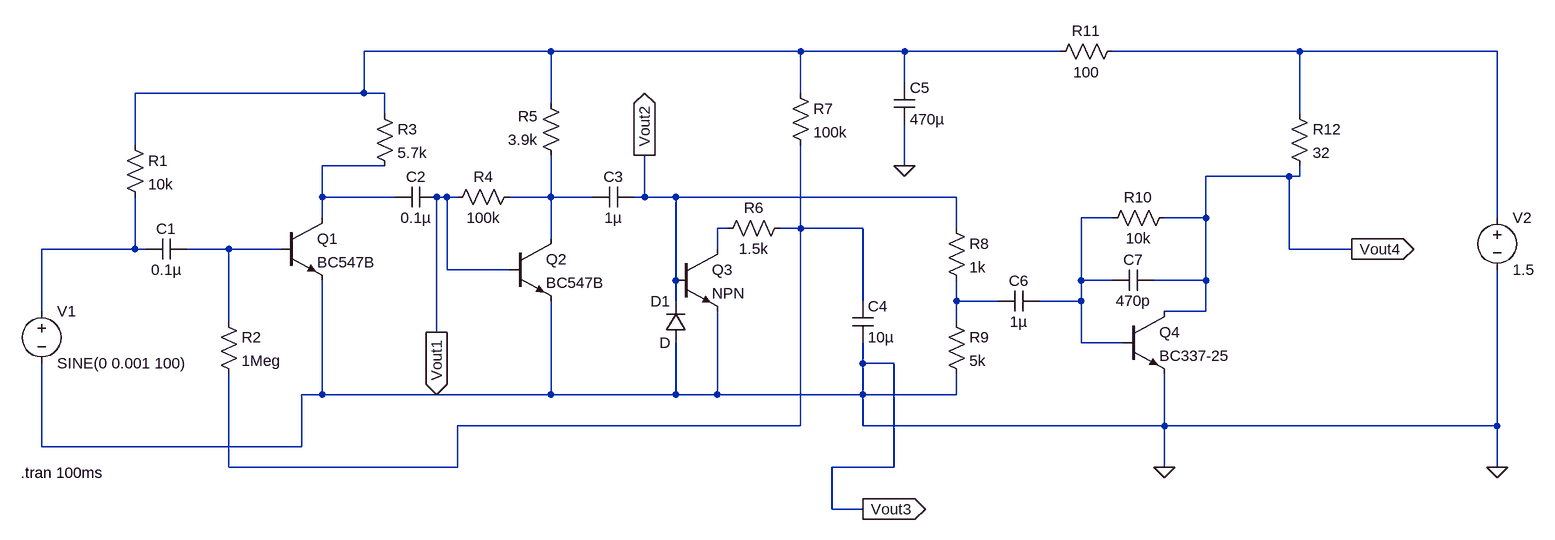
[diagram p0: schematic HearingAid.asc]
HearingAid.asc, the LTspice schematic file:
Version 4
SHEET 1 2432 688
WIRE 496 -128 208 -128
WIRE 880 -128 496 -128
WIRE 1040 -128 880 -128
WIRE 1280 -128 1040 -128
WIRE 1648 -128 1360 -128
WIRE 1952 -128 1648 -128
WIRE 1040 -80 1040 -128
WIRE 208 -64 208 -128
WIRE 208 -64 -144 -64
WIRE 240 -64 208 -64
WIRE 880 -64 880 -128
WIRE 496 -48 496 -128
WIRE 240 -32 240 -64
WIRE 1648 -32 1648 -128
WIRE -144 16 -144 -64
WIRE 240 48 144 48
WIRE 1040 48 1040 -16
WIRE 1632 64 1504 64
WIRE 1648 64 1648 48
WIRE 1648 64 1632 64
WIRE 144 96 144 48
WIRE 256 96 144 96
WIRE 336 96 320 96
WIRE 352 96 336 96
WIRE 496 96 496 32
WIRE 496 96 432 96
WIRE 560 96 496 96
WIRE 640 96 640 32
WIRE 640 96 624 96
WIRE 688 96 640 96
WIRE 1120 96 688 96
WIRE 144 128 144 96
WIRE 1360 128 1312 128
WIRE 1504 128 1504 64
WIRE 1504 128 1440 128
WIRE 1952 128 1952 -128
WIRE 768 144 752 144
WIRE 880 144 880 16
WIRE 880 144 848 144
WIRE 976 144 880 144
WIRE 1120 144 1120 96
WIRE 496 160 496 96
WIRE -144 176 -144 96
WIRE -144 176 -288 176
WIRE -128 176 -144 176
WIRE 0 176 -64 176
WIRE 80 176 0 176
WIRE 752 176 752 144
WIRE 1632 176 1632 64
WIRE 1728 176 1632 176
WIRE 336 208 336 96
WIRE 432 208 336 208
WIRE 688 224 688 96
WIRE 1312 224 1312 128
WIRE 1360 224 1312 224
WIRE 1504 224 1504 128
WIRE 1504 224 1424 224
WIRE 688 256 688 224
WIRE 976 256 976 144
WIRE 1120 256 1120 224
WIRE 1184 256 1120 256
WIRE 1312 256 1312 224
WIRE 1312 256 1248 256
WIRE -288 272 -288 176
WIRE 1504 272 1504 224
WIRE 1504 272 1440 272
WIRE 0 288 0 176
WIRE 1120 288 1120 256
WIRE 320 304 320 96
WIRE 1312 320 1312 256
WIRE 1376 320 1312 320
WIRE 976 352 976 320
WIRE 1024 352 976 352
WIRE 144 400 144 224
WIRE 144 400 112 400
WIRE 496 400 496 256
WIRE 496 400 144 400
WIRE 688 400 688 320
WIRE 688 400 496 400
WIRE 752 400 752 272
WIRE 752 400 688 400
WIRE 976 400 976 352
WIRE 976 400 752 400
WIRE 1120 400 1120 368
WIRE 1120 400 976 400
WIRE 880 448 880 144
WIRE 880 448 352 448
WIRE 976 448 976 400
WIRE 1440 448 1440 368
WIRE 1440 448 976 448
WIRE 1952 448 1952 208
WIRE 1952 448 1440 448
WIRE -288 480 -288 352
WIRE 112 480 112 400
WIRE 112 480 -288 480
WIRE 0 512 0 368
WIRE 352 512 352 448
WIRE 352 512 0 512
WIRE 1024 512 1024 352
WIRE 1024 512 928 512
WIRE 1440 512 1440 448
WIRE 1952 512 1952 448
WIRE 928 576 928 512
WIRE 976 576 928 576
FLAG 1952 512 0
FLAG 976 576 Vout3
IOPIN 976 576 Out
FLAG 1040 48 0
FLAG 1440 512 0
FLAG 320 304 Vout1
IOPIN 320 304 Out
FLAG 640 32 Vout2
IOPIN 640 32 Out
FLAG 1728 176 Vout4
IOPIN 1728 176 Out
SYMBOL npn 80 128 R0
SYMATTR InstName Q1
SYMATTR Value BC547B
SYMBOL res -160 0 R0
SYMATTR InstName R1
SYMATTR Value 10k
SYMBOL res 224 -48 R0
SYMATTR InstName R3
SYMATTR Value 5.7k
SYMBOL voltage -288 256 R0
WINDOW 123 0 0 Left 0
WINDOW 39 0 0 Left 0
SYMATTR InstName V1
SYMATTR Value SINE(0 0.001 100)
SYMBOL voltage 1952 112 R0
WINDOW 123 0 0 Left 0
WINDOW 39 0 0 Left 0
SYMATTR InstName V2
SYMATTR Value 1.5
SYMBOL cap -64 160 R90
WINDOW 0 0 32 VBottom 2
WINDOW 3 32 32 VTop 2
SYMATTR InstName C1
SYMATTR Value 0.1µ
SYMBOL cap 320 80 R90
WINDOW 0 0 32 VBottom 2
WINDOW 3 32 32 VTop 2
SYMATTR InstName C2
SYMATTR Value 0.1µ
SYMBOL res -16 272 R0
SYMATTR InstName R2
SYMATTR Value 1Meg
SYMBOL res 448 80 R90
WINDOW 0 0 56 VBottom 2
WINDOW 3 32 56 VTop 2
SYMATTR InstName R4
SYMATTR Value 100k
SYMBOL res 512 48 R180
WINDOW 0 36 76 Left 2
WINDOW 3 36 40 Left 2
SYMATTR InstName R5
SYMATTR Value 3.9k
SYMBOL npn 432 160 R0
SYMATTR InstName Q2
SYMATTR Value BC547B
SYMBOL cap 624 80 R90
WINDOW 0 0 32 VBottom 2
WINDOW 3 32 32 VTop 2
SYMATTR InstName C3
SYMATTR Value 1µ
SYMBOL diode 704 320 R180
WINDOW 0 24 64 Left 2
WINDOW 3 24 0 Left 2
SYMATTR InstName D1
SYMBOL npn 688 176 R0
SYMATTR InstName Q3
SYMBOL res 864 128 R90
WINDOW 0 0 56 VBottom 2
WINDOW 3 32 56 VTop 2
SYMATTR InstName R6
SYMATTR Value 1.5k
SYMBOL res 864 -80 R0
SYMATTR InstName R7
SYMATTR Value 100k
SYMBOL cap 960 256 R0
SYMATTR InstName C4
SYMATTR Value 10µ
SYMBOL cap 1024 -80 R0
SYMATTR InstName C5
SYMATTR Value 470µ
SYMBOL res 1104 128 R0
SYMATTR InstName R8
SYMATTR Value 1k
SYMBOL res 1104 272 R0
SYMATTR InstName R9
SYMATTR Value 5k
SYMBOL res 1456 112 R90
WINDOW 0 0 56 VBottom 2
WINDOW 3 32 56 VTop 2
SYMATTR InstName R10
SYMATTR Value 10k
SYMBOL res 1376 -144 R90
WINDOW 0 0 56 VBottom 2
WINDOW 3 32 56 VTop 2
SYMATTR InstName R11
SYMATTR Value 100
SYMBOL npn 1376 272 R0
SYMATTR InstName Q4
SYMATTR Value BC337-25
SYMBOL cap 1248 240 R90
WINDOW 0 0 32 VBottom 2
WINDOW 3 32 32 VTop 2
SYMATTR InstName C6
SYMATTR Value 1µ
SYMBOL cap 1424 208 R90
WINDOW 0 0 32 VBottom 2
WINDOW 3 32 32 VTop 2
SYMATTR InstName C7
SYMATTR Value 470p
SYMBOL res 1632 -48 R0
SYMATTR InstName R12
SYMATTR Value 32
TEXT -320 520 Left 2 !.tran 100ms

The netlist it stands for:
* HearingAid.asc
Q1 N003 N009 0 0 BC547B
R1 N001 N008 10k
R3 N001 N003 5.7k
V1 N008 0 SINE(0 0.001 100)
V2 N002 0 1.5
C1 N009 N008 0.1µ
C2 Vout1 N003 0.1µ
R2 N009 N007 1Meg
R4 N004 Vout1 100k
R5 N004 N001 3.9k
Q2 N004 Vout1 0 0 BC547B
C3 Vout2 N004 1µ
D1 0 Vout2 D
Q3 N006 Vout2 0 0 NPN
R6 N007 N006 1.5k
R7 N001 N007 100k
C4 N007 0 10µ
C5 N001 0 470µ
R8 Vout2 N010 1k
R9 N010 0 5k
R10 Vout4 N005 10k
R11 N002 N001 100
Q4 Vout4 N005 0 0 BC337-25
C6 N005 N010 1µ
C7 Vout4 N005 470p
R12 N002 Vout4 32
.model D D
.lib standard.dio
.model NPN NPN
.model PNP PNP
.lib standard.bjt
.tran 100ms
.backanno
.end